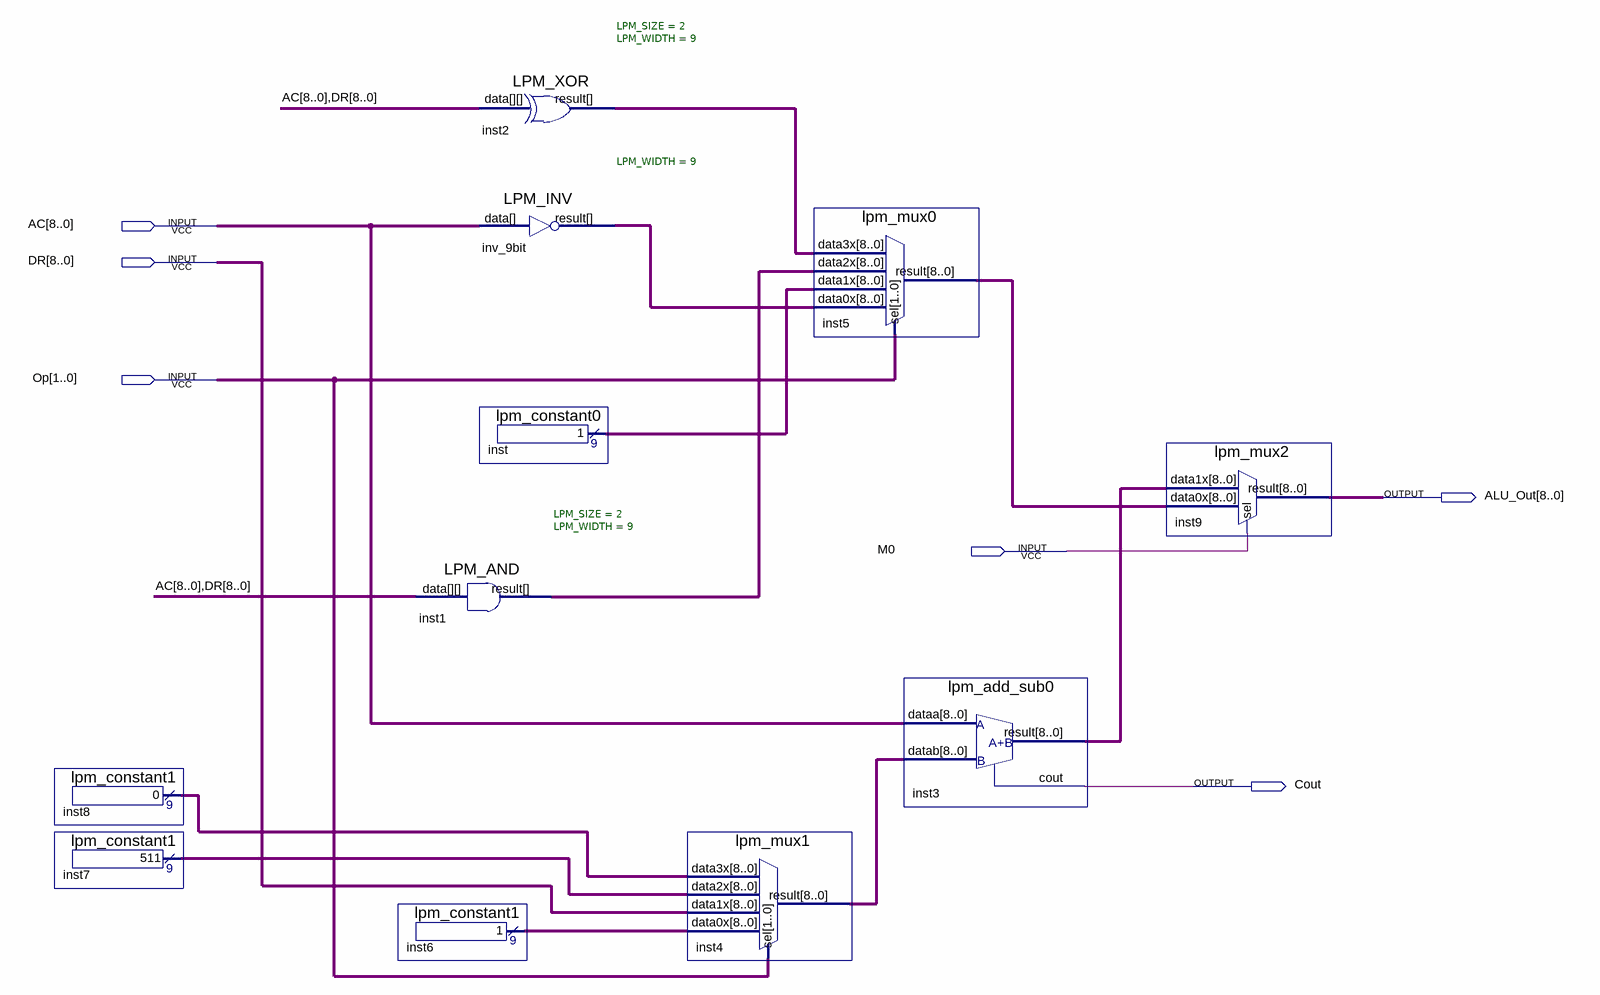
[diagram p0: schematic sheet]
// Quartus schematic ALU.bdf as structural Verilog: 11 symbols, 6 pins
module ALU (
  input  [8:0] AC,
  input  [8:0] DR,
  input  [1:0] Op,
  input  M0,
  output [8:0] ALU_Out,
  output Cout
);

  wire [8:0] inst1_result, inst2_result, inst3_result, inst4_result, inst5_result, inst6_result,
       inst7_result, inst8_result, inst_result, inv_9bit_result;

  lpm_constant1 inst8 (.result(inst8_result));
  lpm_constant1 inst7 (.result(inst7_result));
  LPM_AND #(.LPM_SIZE(2), .LPM_WIDTH(9)) inst1 (.data({AC, DR}), .result(inst1_result));
  lpm_constant1 inst6 (.result(inst6_result));
  LPM_XOR #(.LPM_SIZE(2), .LPM_WIDTH(9)) inst2 (.data({AC, DR}), .result(inst2_result));
  LPM_INV #(.LPM_WIDTH(9)) inv_9bit (.data(AC), .result(inv_9bit_result));
  lpm_constant0 inst (.result(inst_result));
  lpm_mux1 inst4 (
    .data3x(inst8_result), .data2x(inst7_result), .data1x(DR), .data0x(inst6_result), .sel(Op),
    .result(inst4_result));
  lpm_mux0 inst5 (
    .data3x(inst2_result), .data2x(inst1_result), .data1x(inst_result), .data0x(inv_9bit_result), .sel(Op),
    .result(inst5_result));
  lpm_add_sub0 inst3 (.dataa(AC), .datab(inst4_result), .result(inst3_result), .cout(Cout));
  lpm_mux2 inst9 (.data1x(inst3_result), .data0x(inst5_result), .sel(M0), .result(ALU_Out));
endmodule
